# EAGLE design tian_light_servo_revc (EAGLE 6.1)
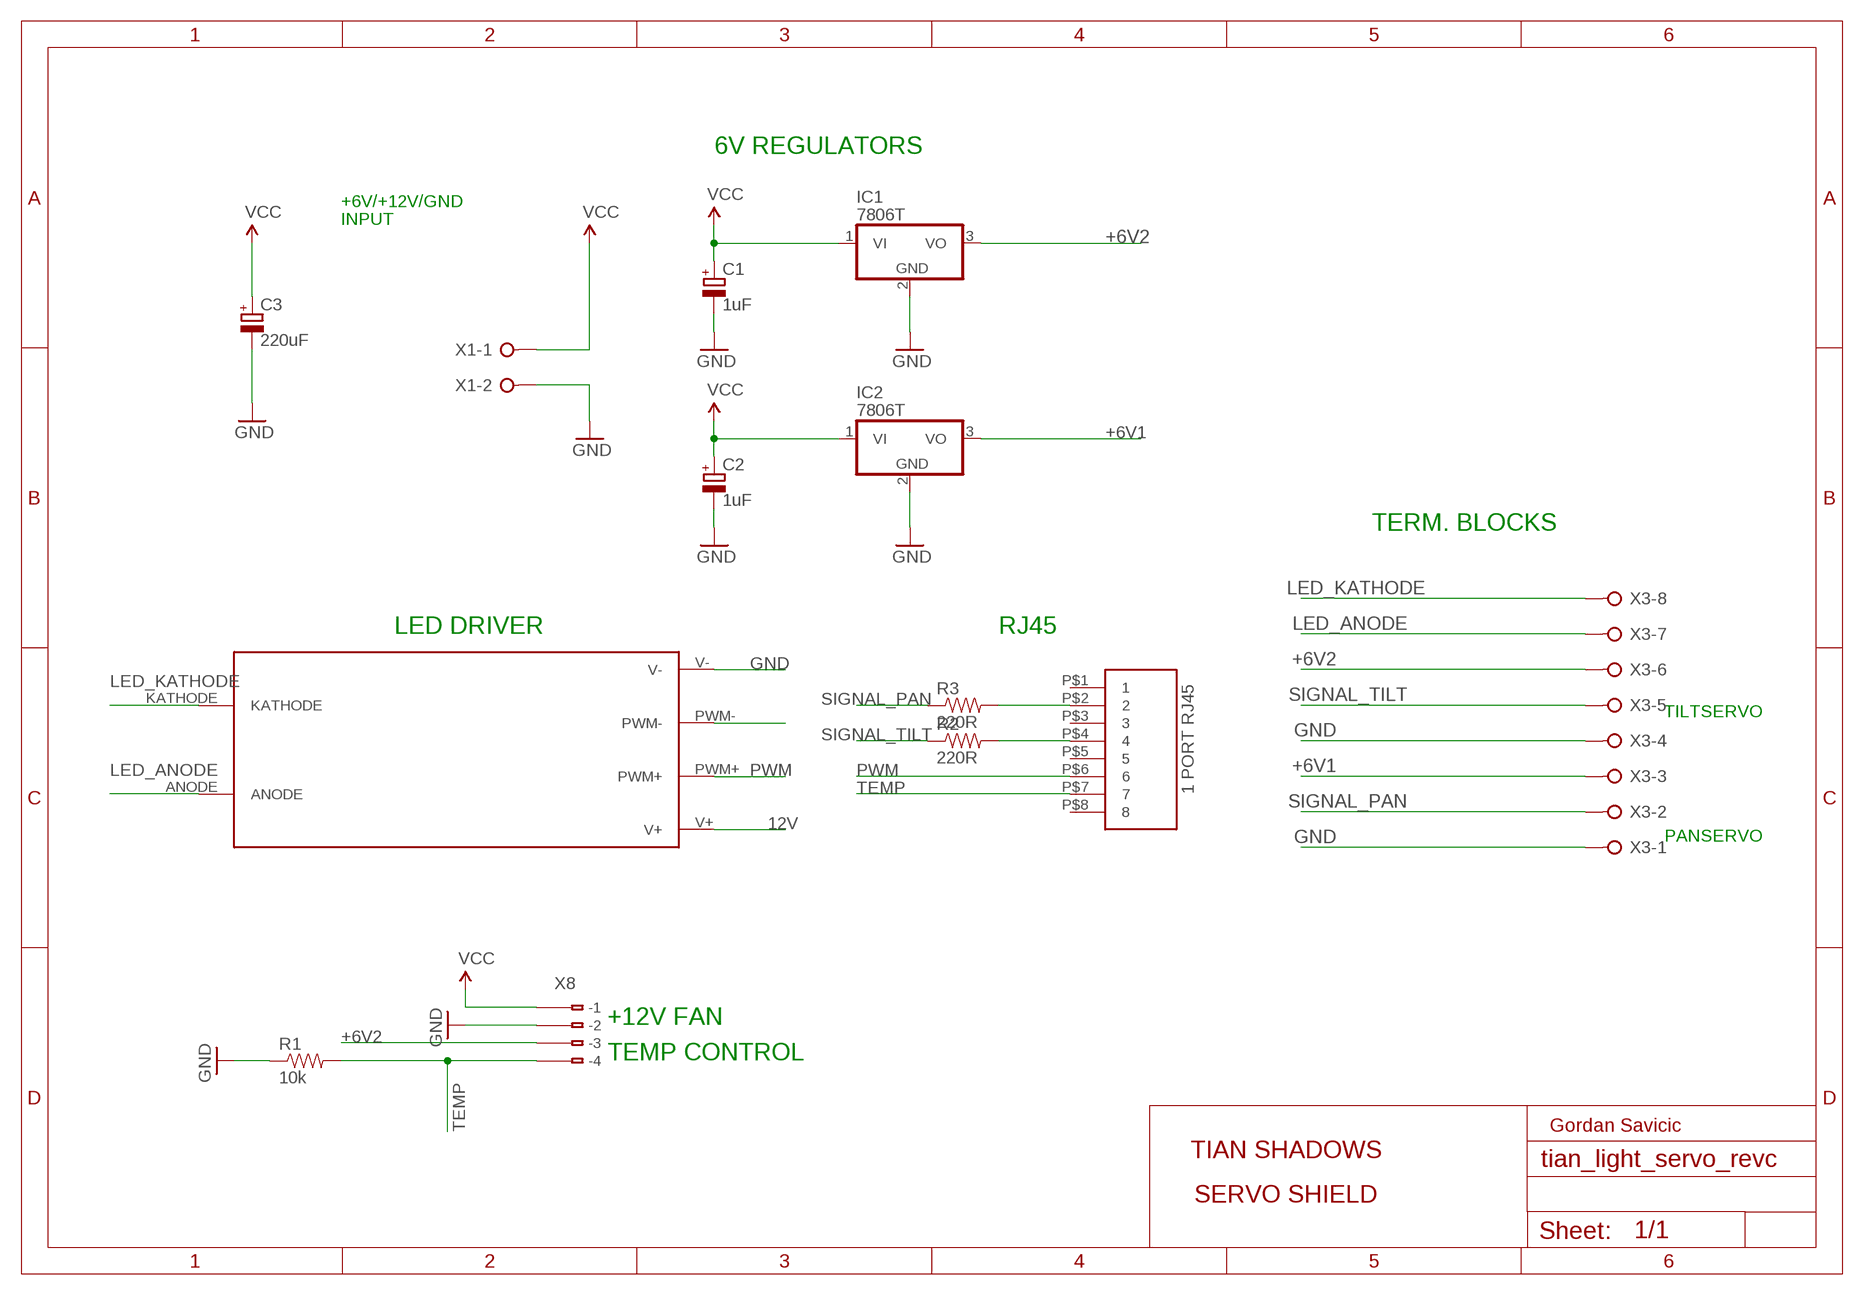
[diagram p0: schematic, sheet 1]

## Parts
C1  1uF  CPOL-EUSMCC  [SMC_C]
C2  1uF  CPOL-EUSMCC  [SMC_C]
C3  220uF  CPOL-EU153CLV-0605  [153CLV-0605]
IC1  7806T  [TO220H]
IC2  7806T  [TO220H]
R1  10k  RESISTOR1206  [1206]
R2  220R  RESISTOR1206  [1206]
R3  220R  RESISTOR1206  [1206]
U$1  BUCK_LED_DRIVER  [BUCK_LED_DRIVER]
U$5  1PORT_ETHERNET  [1PORT_ETHERNET]
X1  W237-02P  [W237-132]
X3  W237-08P  [W237-8P]
X8  233-104  [233-104]

## Nets
12V: C1.+ C2.+ C3.+ IC1.1(VI) IC2.1(VI) U$1.V+ X1.1 X8.B1(B-1) ; supply symbol labelled VCC
+6V1: IC2.3(VO) X3.3
+6V2: IC1.3(VO) X3.6 X8.B3(B-3)
GND: C1.- C2.- C3.- IC1.2(GND) IC2.2(GND) R1.1 U$1.V- X1.2 X3.1 X3.4 X8.B2(B-2)
LED_ANODE: U$1.ANODE X3.7
LED_KATHODE: U$1.KATHODE X3.8
N$1: R2.2 U$5.P$4
N$2: R3.2 U$5.P$2
N$5: U$1.PWM-
PWM: U$1.PWM+ U$5.P$6
SIGNAL_PAN: R3.1 X3.2
SIGNAL_TILT: R2.1 X3.5
TEMP: R1.2 U$5.P$7 X8.B4(B-4)
Unconnected: U$5.P$1 U$5.P$3 U$5.P$5 U$5.P$8 X8.A1(-1) X8.A2(-2) X8.A3(-3) X8.A4(-4)

## Notes on the sheet
- 6V REGULATORS
- +6V/+12V/GND
- INPUT
- TERM. BLOCKS
- LED DRIVER | RJ45
- TILTSERVO
- PANSERVO
- +12V FAN
- TEMP CONTROL
- Gordan Savicic
- TIAN SHADOWS
- SERVO SHIELD

## Library data of the parts
C1 C2 = resistor:CPOL-EU: POLARIZED CAPACITOR, European symbol
C3 = rcl:CPOL-EU: POLARIZED CAPACITOR, European symbol
IC1 IC2 = linear:78*: Positive VOLTAGE REGULATOR Source: http://cache.national.com/ds/LM/LM78L05.pdf http://www.fairchildsemi.com/ds/LM/LM7805.pdf
R1-R3 = SparkFun:RESISTOR: Resistor Basic schematic elements and footprints for 0603, 1206, and PTH resistors.
U$1 = tian:BUCK_LED_DRIVER
U$5 = strukt:1PORT_ETHERNET
X1 = con-wago-508:W237-02P: WAGO SREW CLAMP; OC_FARNELL: unknown; OC_NEWARK: unknown
X3 = con-wago-508:W237-08P: WAGO SREW CLAMP; OC_FARNELL: unknown; OC_NEWARK: unknown
X8 = con-wago:233-104: WAGO Cage Clamp; MPN: 233-104; OC_FARNELL: unknown; OC_NEWARK: 28K9046

## Board
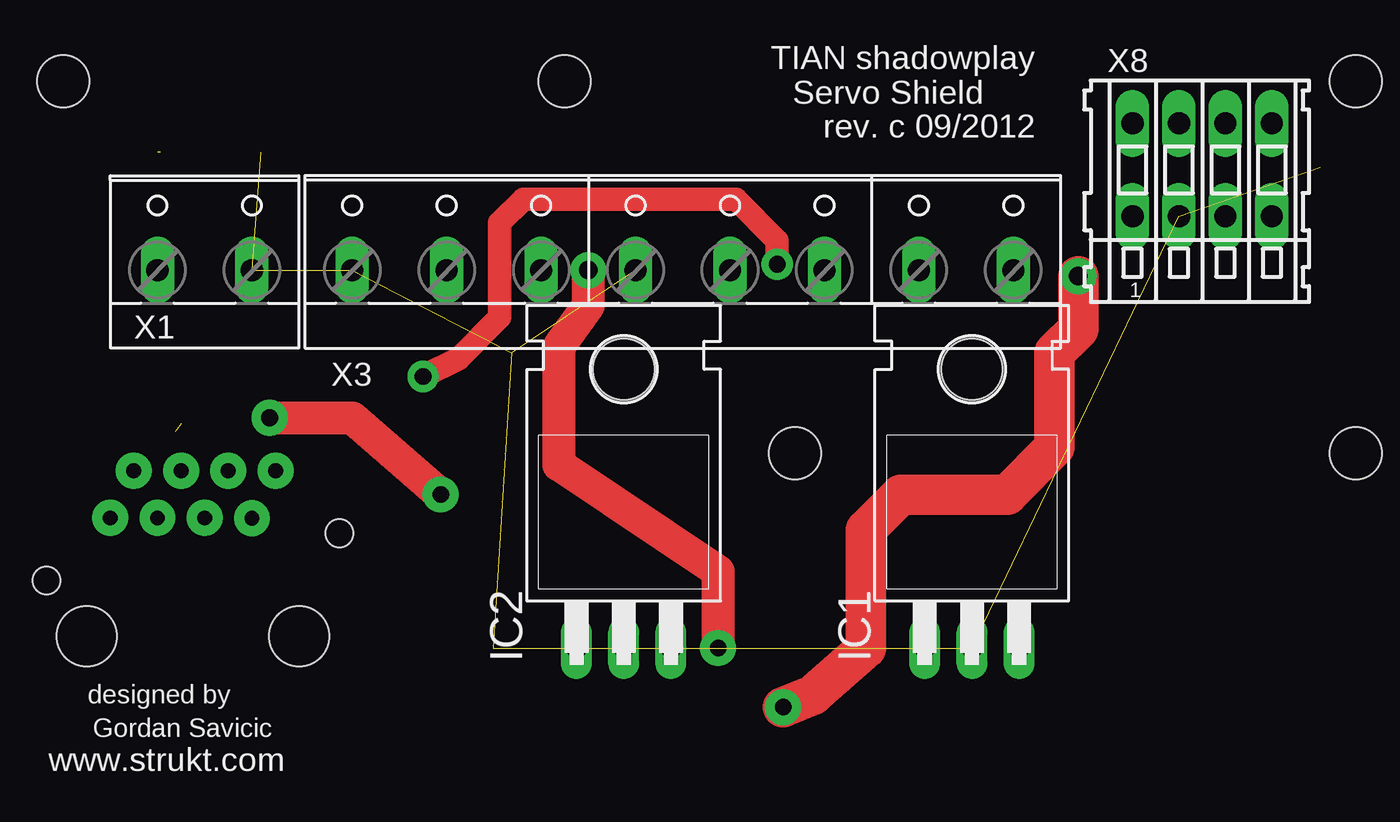
[diagram p1: board, top side]
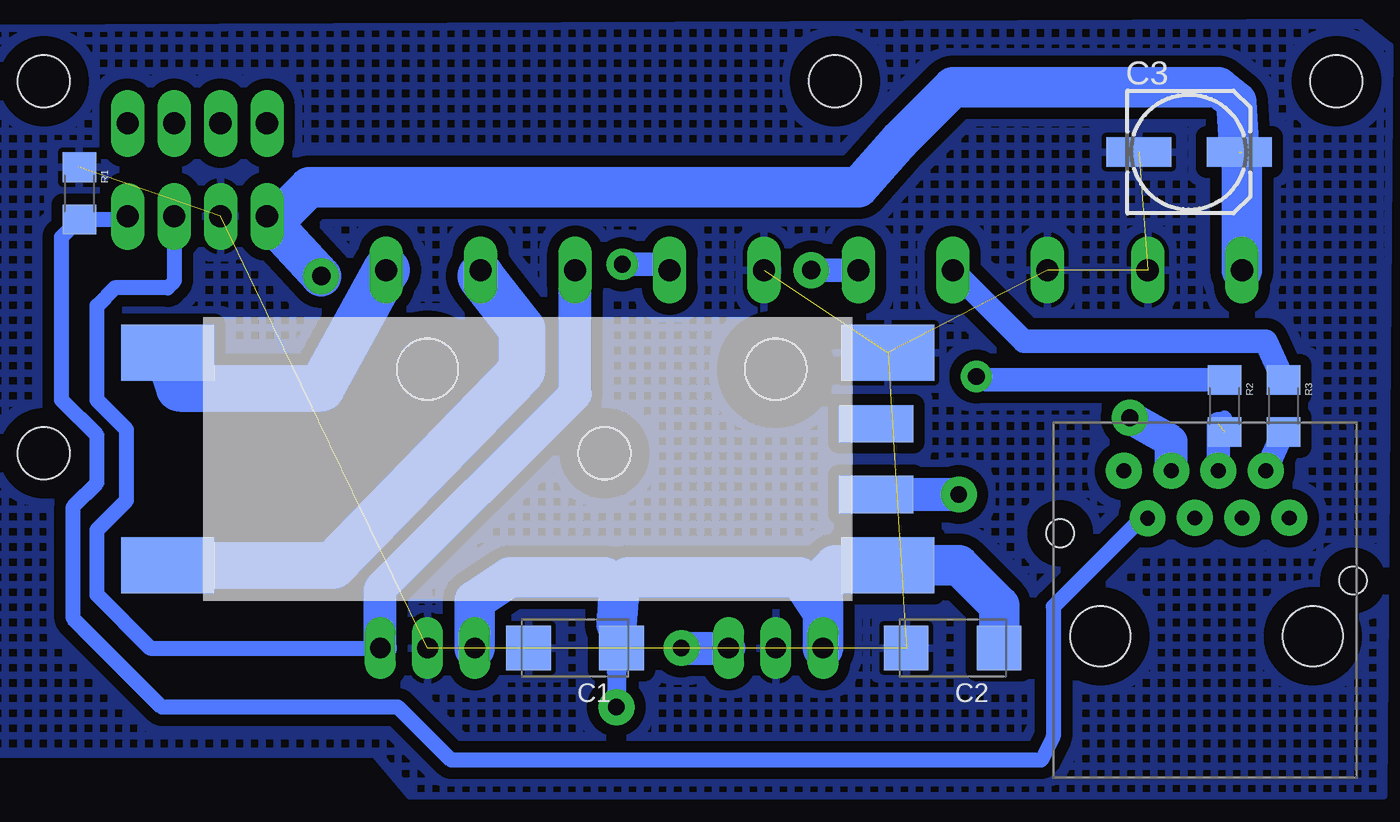
[diagram p2: board, bottom side, seen from below]

No outline drawn. Coordinates in mm, seen from the top.
Copper layers (1*16): Top 0.035mm / dielectric 1.5mm / Bottom 0.035mm
Design rules: minimum track width 10mil, minimum drill 24mil, track to track 8mil, track to pad 8mil, pad to pad 8mil, via to via 8mil, smd to smd 8mil, copper to edge 40mil, drill to drill 8mil, minimum pad ring 10mil, minimum via ring 8mil, stop-mask expansion 4mil, vias tented up to drill 0mil, thermal gap 10mil
Holes 2.8 mm at 30.16,36.83 42.55,16.83 72.71,16.83 72.71,36.83 3.17,36.83

### Footprints (pad centres in the part's own frame; a part is rotated, then mirrored left to right if it is on the bottom)
SMC_C = smd 2.4 x 2.4: + -2.5,0; - 2.5,0
153CLV-0605 = smd 3.5 x 1.6: + 2.7,0; - -2.7,0
TO220H = drill 1.118 long: 1 -2.54,-10.16; 2 0,-10.16; 3 2.54,-10.16 | hole 3.302: 0,4.826
1206 = smd 1.6 x 1.8: 1 -1.4,0; 2 1.4,0
BUCK_LED_DRIVER = smd 5 x 3: ANODE -1.905,1.905; KATHODE -1.905,13.335; V+ 36.83,1.905; V- 36.83,13.335 | smd 4 x 2: PWM+ 36.195,5.715; PWM- 36.195,9.525
1PORT_ETHERNET = drill 0.8 pad 1.93: P$1 -3.82,3.81; P$2 -6.36,2.54; P$3 -3.82,1.27; P$4 -6.36,0; P$5 -3.82,-1.27; P$6 -6.35,-2.54; P$7 -3.81,-3.81; P$8 -6.35,-5.08 | hole 3.25: 2.54,-6.35; 2.54,5.08 | hole 1.5: -3,-8.51; -0.46,7.24
W237-132 = drill 1.194 long: 1 -2.54,-0.635; 2 2.54,-0.635
W237-8P = drill 1.194 long: 1 -17.78,-0.635; 2 -12.7,-0.635; 3 -7.62,-0.635; 4 -2.54,-0.635; 5 2.54,-0.635; 6 7.62,-0.635; 7 12.7,-0.635; 8 17.78,-0.635
233-104 = drill 1.2 long: A1 -3.75,2.5; A2 -1.25,2.5; A3 1.25,2.5; A4 3.75,2.5; B1 -3.75,-2.5; B2 -1.25,-2.5; B3 1.25,-2.5; B4 3.75,-2.5

### Placement (x,y rotation side)
C1  44.13,6.35 180 bottom
C2  23.81,6.35 180 bottom
C3  11.11,33.02 0 bottom
IC1  52.07,16.51 0 top
IC2  33.34,16.51 0 top
R1  70.8,30.8 270 bottom
R2  9.21,19.37 270 bottom
R3  6.03,19.37 270 bottom
U$1  64.14,8.89 0 bottom
U$5  9.53,9.53 270 bottom
X1  10.79,27.3 0 top
X3  36.51,27.3 0 top
X8  64.45,32.07 0 top

### Tracks (layer width: path | path; a pad name or v marks a point on that pad's centre or on a via)
12V  (via drill 0.9 pad 1.93, 1 pad 1.93)  (1 unrouted)
  Top 2.184: v41.91,3.17 43.5,3.81 46.35,6.35 46.35,12.7 48.26,14.61 53.98,14.61 56.52,17.14 56.52,22.23 57.78,23.5 v57.78,26.35
  Bottom 1.016: 41.91,7.62 41.91,6.39 C1.+ 41.91,5.08 v41.91,3.17 | 60.4,29.16 60.74,29.53 X8.B1 | IC2.1 30.8,8.26
  Bottom 1.778: 42.55,10.16 41.75,9.68
  Bottom 2.184: IC2.1 30.8,10.16 30.16,10.79 U$1.V+ 23.5,10.79 21.31,8.61 C2.+ | IC1.1 49.53,8.89 47.62,10.16 42.55,10.16 | 41.91,7.62 41.75,9.68 41.27,10.16 32.07,10.16 30.8,8.26 | v57.78,26.35 60.4,29.16 58.45,31.11 28.89,31.11 26.67,33.66 23.81,36.51 9.53,36.51 8.57,35.72 C3.+ | X1.1 8.26,33.02
+6V1  (via drill 0.9 pad 1.93, 1 pad 1.93)
  Top 1.778: v38.42,6.35 38.42,10.48 29.84,16.19 29.84,22.54 31.43,24.77 v31.43,26.67
  Bottom 1.27: X3.3 v31.43,26.67
  Bottom 1.778: v38.42,6.35 IC2.3
+6V2
  Bottom 0.813: X8.B3 65.7,26.05 66.04,25.72 68.9,25.72 69.85,24.77 69.85,19.68 68.26,18.1 68.26,14.29 69.85,12.7 69.85,9.21 66.99,6.35 IC1.3
  Bottom 1.778: IC1.3 54.61,9.53 44.13,20 X3.6
GND  (10 unrouted)
  pour Bottom (isolate 0.61, hatched): 0.64,-1.59 53.02,-1.59 54.93,0.64 75.25,0.64 75.56,39.69 1.91,40.01 0.32,38.73
LED_ANODE
  Bottom 1.016: X3.7 49.21,26.35 49.21,25.4
  Bottom 2.54: U$1.ANODE 57.15,10.79 46.99,21.27 46.99,23.5 49.21,26.35
LED_KATHODE
  Bottom 2.54: U$1.KATHODE 65.41,20.32 57.78,20.32 X3.8
N$1  (1 unrouted)
  Bottom 0.406: U$5.P$4 9.21,15.88
  Bottom 0.813: 9.53,18.41 9.21,18.73
  Bottom 1.27: U$5.P$4 9.53,18.41
N$2
  Bottom 1.27: R3.2 U$5.P$2
PWM  (via drill 0.9 pad 1.93)
  Top 1.778: v14.29,18.73 18.73,18.73 v23.5,14.61
  Bottom 1.778: U$5.P$6 12.06,17.46 v14.29,18.73 | v23.5,14.61 U$1.PWM+
SIGNAL_PAN
  Bottom 1.27: R3.1 6.99,22.86 20,22.86 X3.2
SIGNAL_TILT  (via drill 0.9 pad 1.68)
  Top 1.27: v22.54,20.95 24.45,21.91 26.67,24.13 26.67,29.21 27.94,30.48 39.37,30.48 41.59,28.26 v41.59,26.99
  Bottom 0.813: 22.04,20.77 v22.54,20.95 | 39.37,26.99 X3.5
  Bottom 1.27: R2.1 22.04,20.77 | v41.59,26.99 39.37,26.99
TEMP
  Bottom 0.813: X8.B4 68.37,29.4 R1.2 71.75,28.45 71.75,19.68 69.85,17.78 69.85,15.24 71.12,13.97 71.12,7.94 66.36,3.17 53.66,3.17 50.8,0.32 19.05,0.32 18.41,1.59 18.41,8.57 13.65,13.34 U$5.P$7

### Text on the board
tPlace: TIAN shadowplay | Servo Shield | rev. c 09/2012 | designed by | Gordan Savicic | www.strukt.com